# EAGLE design xerc3-1 (EAGLE 8.1.1)
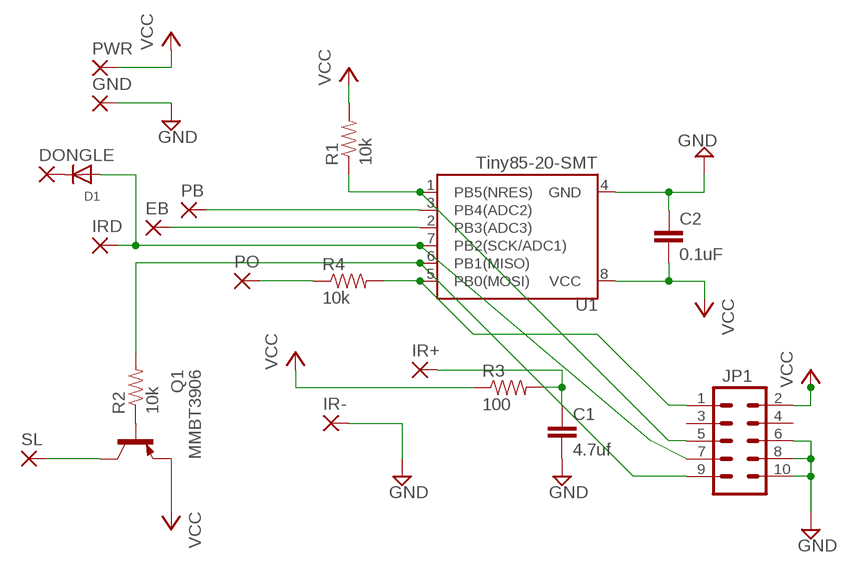
[diagram p0: schematic, sheet 1]

## Parts
C1  4.7uf  CAP0603-CAP  [0603-CAP]
C2  0.1uF  0.1UF-25V(+80/-20%)(0603)  [0603-CAP]
D1  DIODESOD-323F  [SOD-323F]
DONGLE  SMD5  [SMD2,54-5,08]
EB  SMD5  [SMD2,54-5,08]
GND  SMD5  [SMD2,54-5,08]
IR+  SMD5  [SMD2,54-5,08]
IR-  SMD5  [SMD2,54-5,08]
IRD  SMD5  [SMD2,54-5,08]
JP1  M05X2SHD  [2X5-SHROUDED]
MMBT3906  Q1  MMBTA56-SOT23  [SOT23]
PB  SMD5  [SMD2,54-5,08]
PO  SMD5  [SMD2,54-5,08]
PWR  SMD5  [SMD2,54-5,08]
R1  10k  RESISTOR0603  [0603-RES]
R2  10k  RESISTOR0603-RES  [0603-RES]
R3  100  RESISTOR0603  [0603-RES]
R4  10k  RESISTOR0603-RES  [0603-RES]
SL  SMD5  [SMD2,54-5,08]
U1  Tiny85-20-SMT  ATTINY45TINY85-20-SMT  [SO08-EIAJ]

## Nets
GND: C1.2 C2.1 GND.1(P) IR-.1(P) U1.4(GND)
N$1: PB.1(P) U1.3(PB4(ADC2))
N$2: JP1.5 R1.1 U1.1(PB5(NRES))
N$3: EB.1(P) U1.2(PB3(ADC3))
N$4: D1.A IRD.1(P) JP1.7 U1.7(PB2(SCK/ADC1))
N$5: JP1.9 R2.2 U1.6(PB1(MISO))
N$6: MMBT3906.1(B) R2.1
N$7: MMBT3906.3(C) SL.1(P)
N$8: C1.1 IR+.1(P) R3.2
N$9: JP1.1 R4.2 U1.5(PB0(MOSI))
N$10: PO.1(P) R4.1
N$11: D1.C DONGLE.1(P)
N$12: JP1.6 JP1.8 JP1.10 ; supply symbol labelled GND
VCC: C2.2 JP1.2 MMBT3906.2(E) PWR.1(P) R1.2 R3.1 U1.8(VCC)
Unconnected: JP1.3 JP1.4

## Library data of the parts
C1 = SparkFun-Capacitors:CAP: Capacitor Standard 0603 ceramic capacitor, and 0.1" leaded capacitor.
C2 = SparkFun-Capacitors:0.1UF-25V(+80/-20%)(0603): CAP-00810 Ceramic Standard decoupling cap; PROD_ID: CAP-00810
D1 = adafruit:DIODE: Diode SMADIODE - SMA Surface Mount Package 20V 1A Schottky Diode Digikey: 641-1014-6-ND DO-1N4148 - Through Hole Small Current Diode SOD-123 20V 1 A (.5mV Vf) Schottky Diode - Digikey: MBRX120TPMSCT-ND SOD-323 10V 570mA (.38mV Vf, 3ns) Schottky Diode - Digikey: ZLLS410CT-ND SOD-523 30V 30mA Schottky Diode (RB751S-40TE61) - Digikey: RB751S-40TE61CT-ND SOT23-R/W - SOT23 Package (R = Solder Paste/Reflow Ovens, W = Hand-Soldering) BAT54Film 40V 300mA - Digikey: 497-7162-1-ND
DONGLE EB GND IR+ IR- IRD PB PO PWR SL = wirepad:SMD5: SMD PAD
JP1 = SparkFun-Connectors:M05X2: Header 5x2 Standard 10-pin dual row 0.1" header. Commonly used with AVR-ISP. Use with Spark Fun Electronics SKU: PRT-00778
MMBT3906 = transistor-pnp:*-?: PNP Transistor
R1 R3 = SparkFun-Resistors:RESISTOR: Resistor Basic schematic elements and footprints for 0603, 1206, and PTH resistors.
R2 R4 = SparkFun-Passives:RESISTOR: Resistor Basic schematic elements and footprints for 0603, 1206, and PTH resistors.
U1 = SparkFun-DigitalIC:ATTINY45: Atmel 8-pin 2/4/8kB flash uC; PROD_ID: IC-09092

## Board
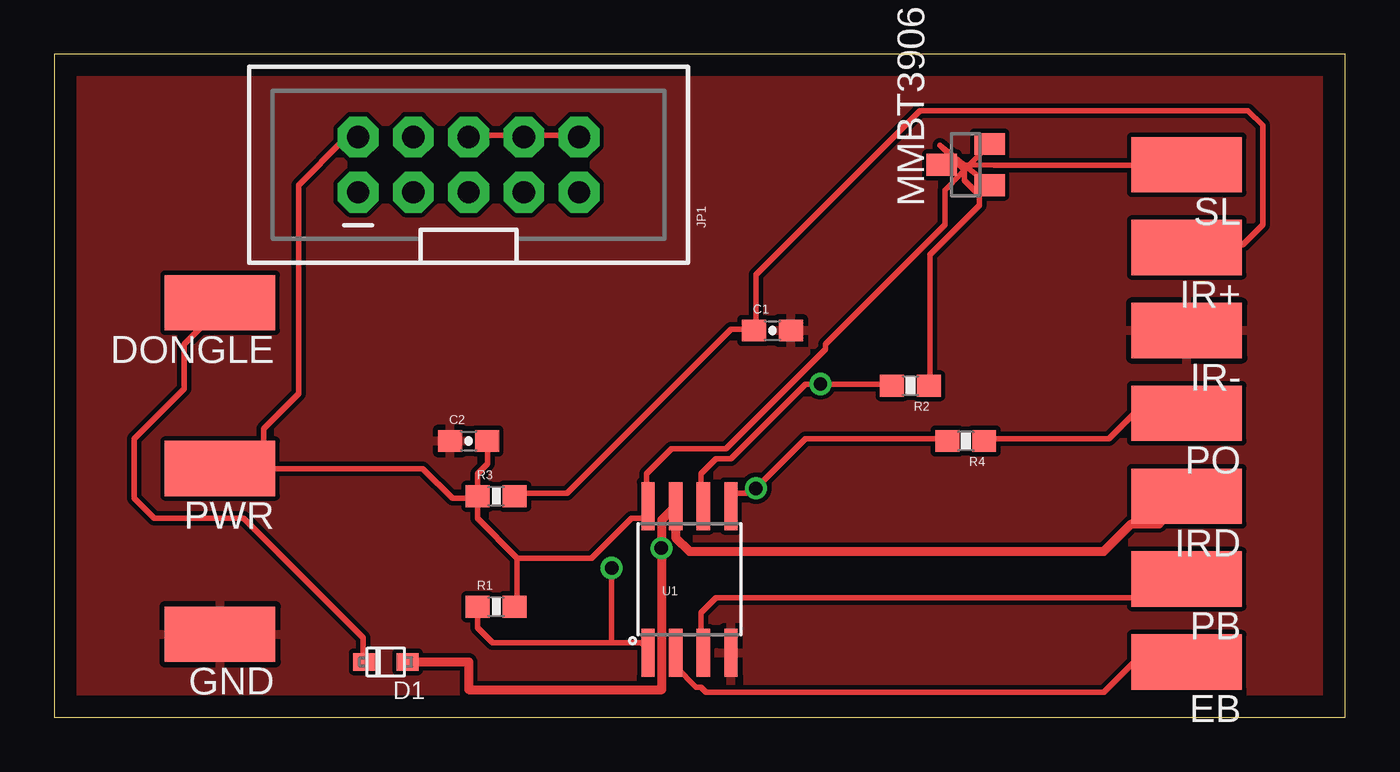
[diagram p1: board, top side]
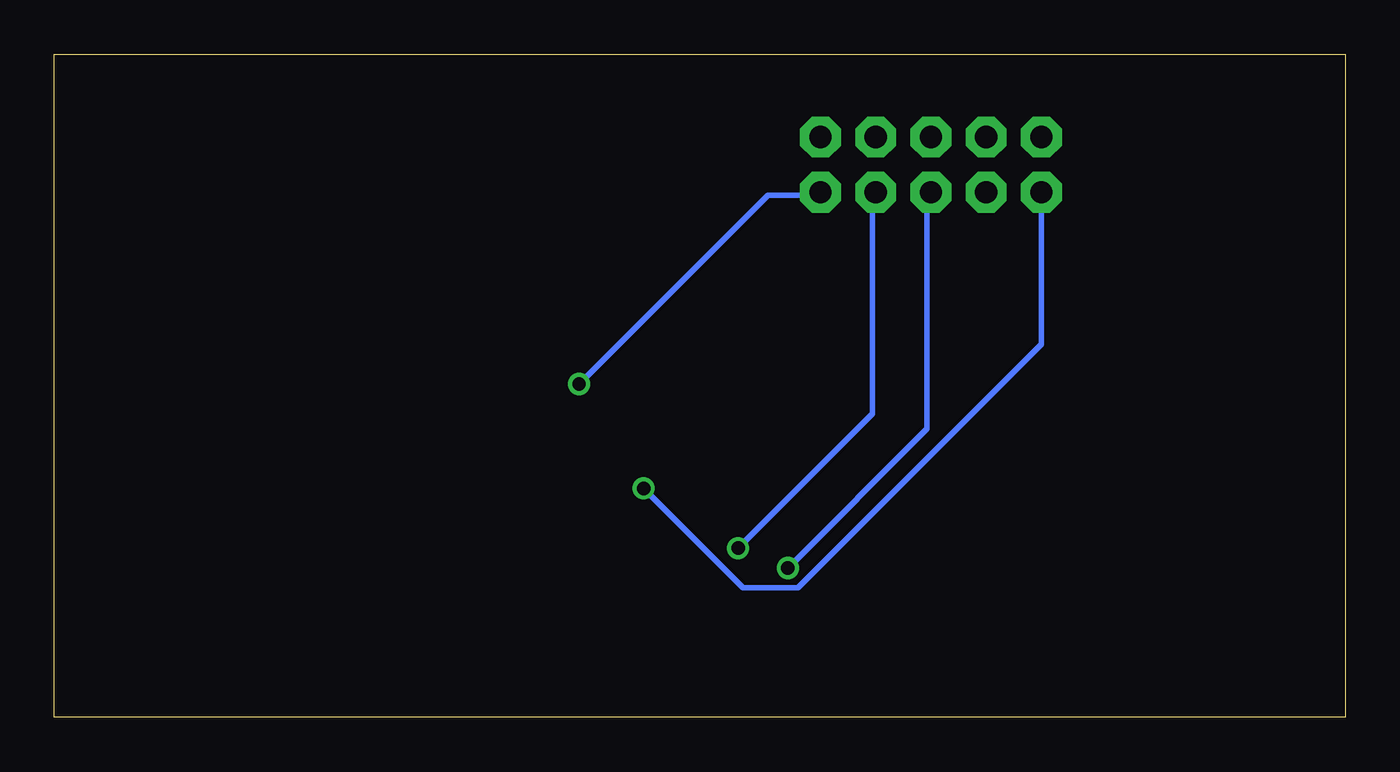
[diagram p2: board, bottom side, seen from below]

Size 59.36 x 30.47 mm. Coordinates in mm from the lower left corner, seen from the top.
Outline: 0,0 59.36,0 59.36,30.47 0,30.47 0,0
Copper layers (1*16): Top 0.035mm / dielectric 1.5mm / Bottom 0.035mm
Design rules "default": minimum track width 10mil, minimum drill 24mil, track to track 8mil, track to pad 8mil, pad to pad 8mil, via to via 8mil, smd to smd 8mil, copper to edge 40mil, drill to drill 8mil, minimum pad ring 10mil, minimum via ring 8mil, stop-mask expansion 4mil, vias tented up to drill 0mil, thermal gap 10mil

### Footprints (pad centres in the part's own frame; a part is rotated, then mirrored left to right if it is on the bottom)
0603-CAP = smd 1.1 x 1: 1 -0.85,0; 2 0.85,0
SOD-323F = smd 1 x 0.8: A -1,0; C 1,0
SMD2,54-5,08 = smd 2.54 x 5.08: 1 0,0
2X5-SHROUDED = drill 1.016 pad 1.88 octagon: 1 -1.27,5.08; 2 1.27,5.08; 3 -1.27,2.54; 4 1.27,2.54; 5 -1.27,0; 6 1.27,0; 7 -1.27,-2.54; 8 1.27,-2.54; 9 -1.27,-5.08; 10 1.27,-5.08
SOT23 = smd 1 x 1.4: 1 -0.95,-1.1; 2 0.95,-1.1; 3 0,1.1
0603-RES = smd 1.1 x 1: 1 -0.85,0; 2 0.85,0
SO08-EIAJ = smd 0.61 x 2.21: 1 -1.905,-3.378; 2 -0.635,-3.378; 3 0.635,-3.378; 4 1.905,-3.378; 5 1.905,3.353; 6 0.635,3.353; 7 -0.635,3.353; 8 -1.905,3.353

### Placement (x,y rotation side)
C1  33.02,17.78 0 top
C2  19.05,12.7 0 top
D1  15.24,2.54 180 top
DONGLE  7.62,19.05 90 top
EB  52.07,2.54 90 top
GND  7.62,3.81 90 top
IR+  52.07,21.59 90 top
IR-  52.07,17.78 90 top
IRD  52.07,10.16 90 top
JP1  19.05,25.4 90 top
MMBT3906  41.91,25.4 90 top
PB  52.07,6.35 90 top
PO  52.07,13.97 90 top
PWR  7.62,11.43 90 top
R1  20.32,5.08 0 top
R2  39.37,15.24 180 top
R3  20.32,10.16 0 top
R4  41.91,12.7 180 top
SL  52.07,25.4 90 top
U1  29.21,6.35 0 top

### Tracks (layer width: path | path; a pad name or v marks a point on that pad's centre or on a via)
GND
  pour Top: 60.96,-1.27 1.27,-1.27 0,-1.27 0,38.1 60.96,38.1
N$1
  Top 0.254: U1.3 29.74,2.97 29.74,4.8 30.43,5.49 51.23,5.49 51.92,6.17 PB.1
N$2  (via drill 0.61)
  Top 0.254: 25.63,3.43 27,3.43 27.46,2.97 U1.1 | 25.63,3.43 20.14,3.43 19.46,4.12 19.46,5.03 R1.1 | 25.63,3.43 v25.63,6.86
  Bottom 0.254: v25.63,6.86 19.23,13.26 19.23,24 JP1.5
N$3
  Top 0.254: U1.2 28.6,2.97 28.6,2.29 29.52,1.37 29.74,1.37 29.97,1.14 48.26,1.14 49.63,2.52 51.92,2.52 EB.1
N$4  (via drill 0.61)
  Top 0.254: v27.91,7.77 27.94,7.77
  Top 0.406: D1.A 19.05,2.54 19.05,1.27 27.94,1.27 27.94,7.77 27.94,9.07 U1.7 28.57,8.26 29.21,7.62 48.26,7.62 49.53,8.89 50.8,8.89 IRD.1
  Bottom 0.254: v27.91,7.77 21.74,13.95 21.74,24 JP1.7
N$5  (via drill 0.61)
  Top 0.254: R2.2 38.43,15.32 v35.23,15.32 34.54,15.32 31.11,11.89 30.43,11.89 29.74,11.2 29.74,9.83 U1.6
  Bottom 0.254: v35.23,15.32 26.54,24 24.26,24 JP1.9
N$6
  Top 0.254: R2.1 40.26,15.32 40.26,21.26 42.55,23.55 42.55,24 41.86,24.69 41.86,25.15 40.72,26.29 MMBT3906.1
N$7
  Top 0.254: MMBT3906.3 43.23,25.38 51.92,25.38 SL.1
N$8
  Top 0.254: R3.2 21.29,10.29 23.57,10.29 31.11,17.83 32.03,17.83 C1.1 32.26,17.83 32.26,20.34 39.8,27.89 54.89,27.89 55.57,27.2 55.57,22.63 54.66,21.72 52.15,21.72 IR+.1
N$9  (via drill 0.61)
  Top 0.254: U1.5 31.11,10.06 31.34,10.29 32.03,10.29 v32.26,10.52 34.54,12.8 40.95,12.8 R4.2
  Bottom 0.254: JP1.1 13.97,17.14 25.17,5.94 27.69,5.94 v32.26,10.52
N$10
  Top 0.254: R4.1 42.77,12.8 48.49,12.8 49.63,13.95 51.92,13.95 PO.1
N$11
  Top 0.254: D1.C 14.2,2.74 14.2,3.66 8.71,9.14 4.6,9.14 3.68,10.06 3.68,12.8 5.97,15.09 5.97,17.14 7.8,18.97 DONGLE.1
N$12
  Top 0.254: JP1.6 19.23,26.75 21.51,26.75 JP1.8 21.74,26.75 24.03,26.75 JP1.10
VCC
  Top 0.254: C2.2 19.91,12.57 19.91,11.66 19.46,11.2 19.46,10.29 R3.1 19.46,10.06 | 21.29,7.32 21.29,5.26 R1.2 | 21.29,7.32 19.46,9.14 19.46,10.06 | MMBT3906.2 40.95,24.23 40.95,22.63 35.46,17.14 35.46,16.92 30.89,12.34 28.37,12.34 27.23,11.2 27.23,9.83 U1.8 27.46,9.6 27.46,9.37 27.23,9.14 26.54,9.14 24.71,7.32 21.29,7.32 | 9.63,11.43 16.94,11.43 18.31,10.06 19.46,10.06 | 9.63,11.43 9.63,13.26 11.23,14.86 11.23,24.46 13.28,26.52 13.97,26.52 JP1.2 | 9.63,11.43 PWR.1